# Altium schematic sheet 03.SchDoc
size 386 x 246 mm
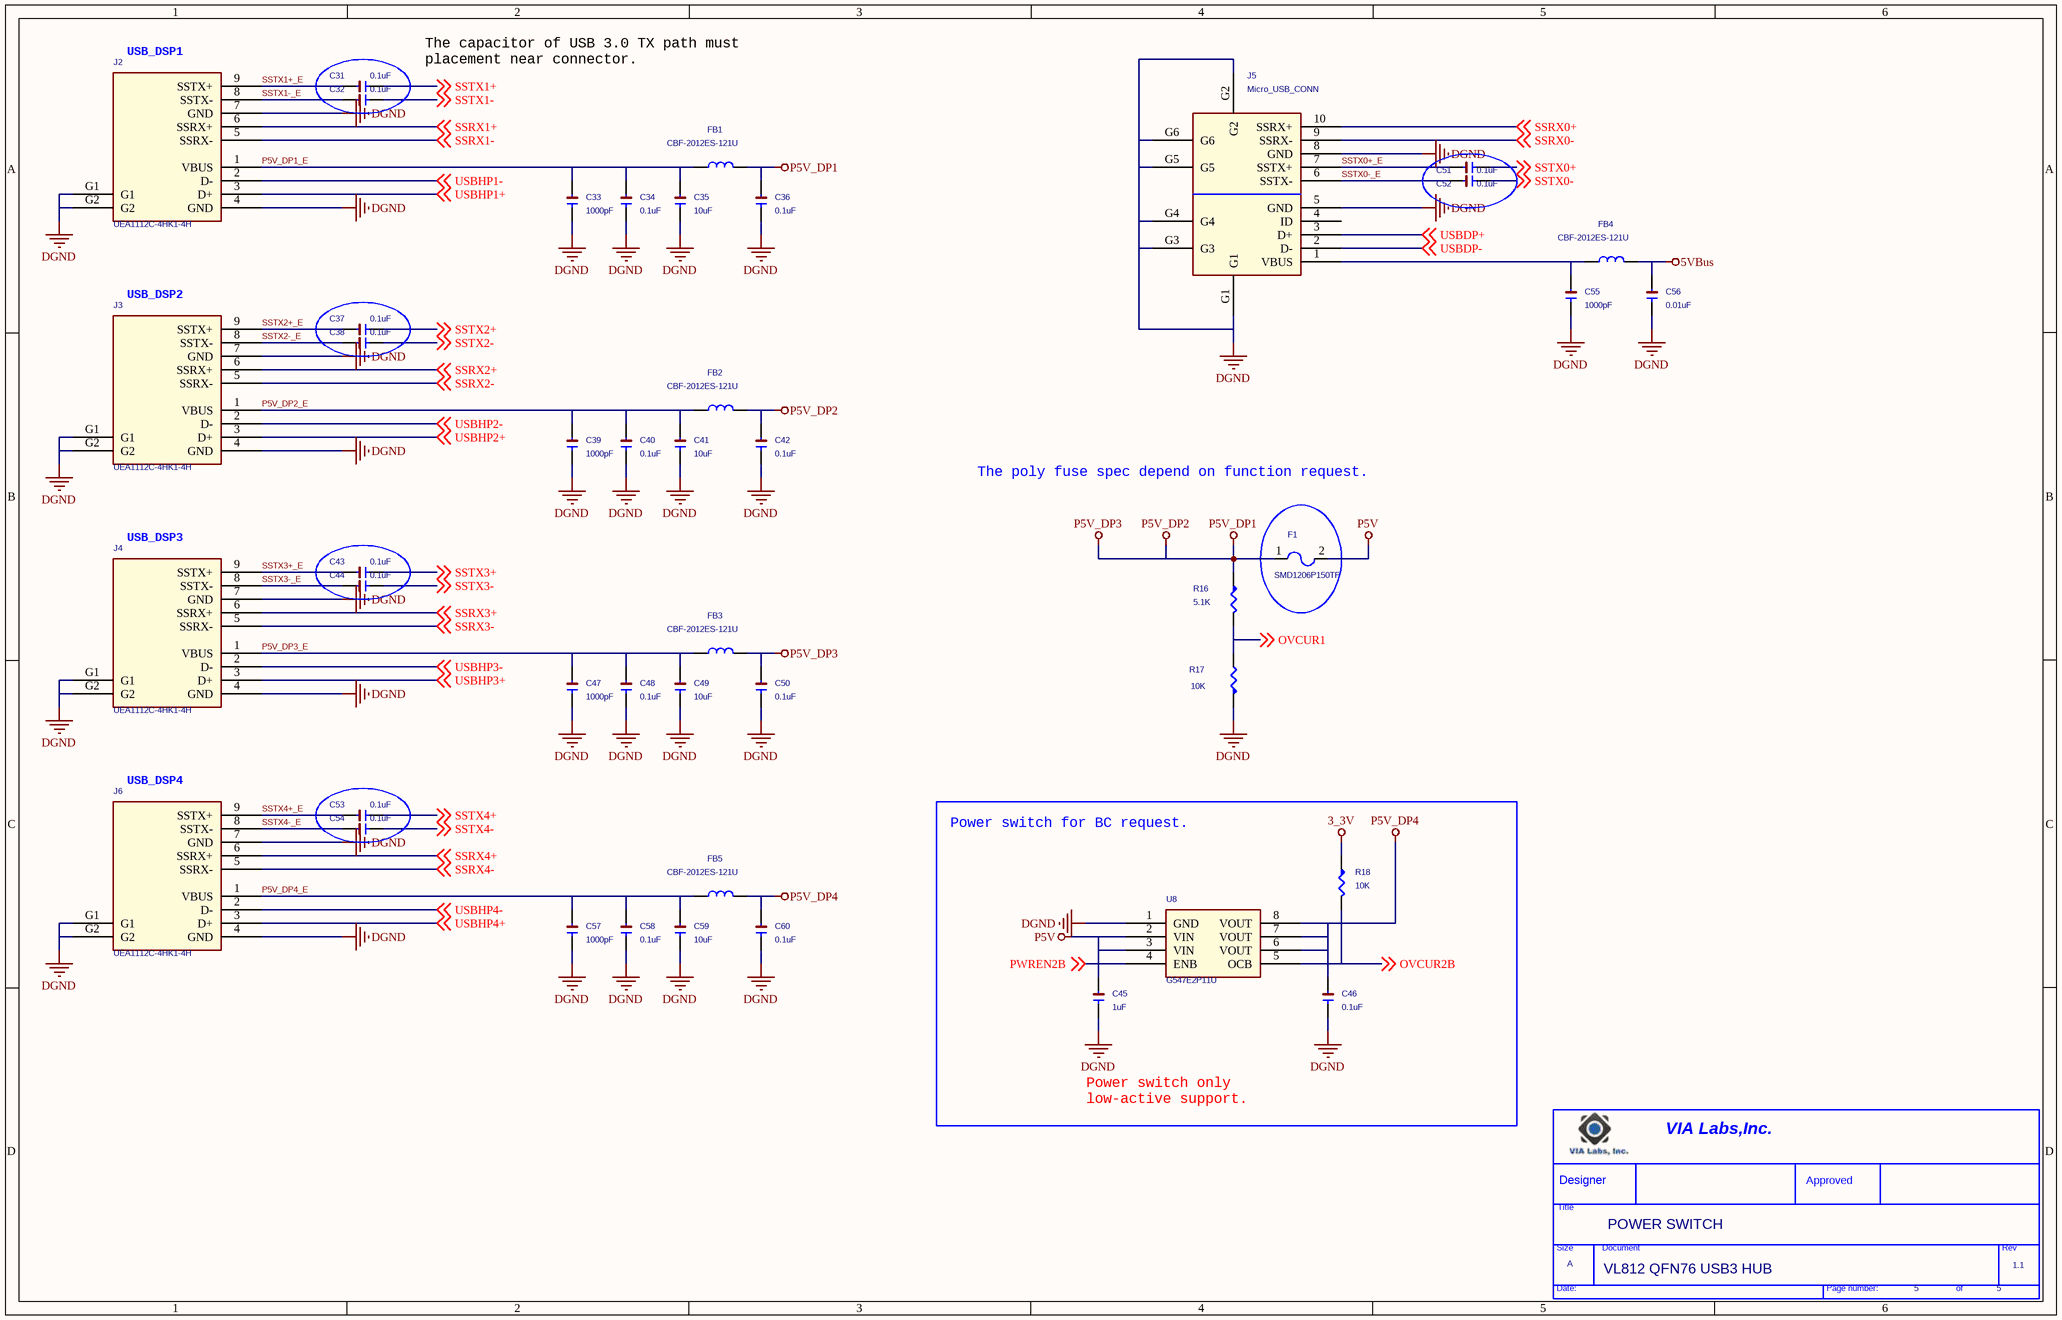
[diagram p0: 03.SchDoc]

## Parts
*  Page Count: 5  Page Size: A  Title: POWER SWITCH  RevCode: 1.1  Doc: VL812 QFN76 USB3 HUB  (hidden comment: TitleBlock0)  (graphical)
C31  0.1uF  [1206]
C32  0.1uF  [1206]
C33  1000pF  [1206]
C34  0.1uF  [1206]
C35  10uF  [1206]
C36  0.1uF  [1206]
C37  0.1uF  [1206]
C38  0.1uF  [1206]
C39  1000pF  [1206]
C40  0.1uF  [1206]
C41  10uF  [1206]
C42  0.1uF  [1206]
C43  0.1uF  [1206]
C44  0.1uF  [1206]
C45  1uF  [1206]
C46  0.1uF  [1206]
C47  1000pF  [1206]
C48  0.1uF  [1206]
C49  10uF  [1206]
C50  0.1uF  [1206]
C51  0.1uF  [1206]
C52  0.1uF  [1206]
C53  0.1uF  [1206]
C54  0.1uF  [1206]
C55  1000pF  [1206]
C56  0.01uF  [1206]
C57  1000pF  [1206]
C58  0.1uF  [1206]
C59  10uF  [1206]
C60  0.1uF  [1206]
F1  SMD1206P150TF  [FUSE1206]
FB1  CBF-2012ES-121U  [BEAD-CB-2012ES]
FB2  CBF-2012ES-121U  [BEAD-CB-2012ES]
FB3  CBF-2012ES-121U  [BEAD-CB-2012ES]
FB4  CBF-2012ES-121U  [BEAD-CB-2012ES]
FB5  CBF-2012ES-121U  [BEAD-CB-2012ES]
J2  UEA1112C-4HK1-4H  [USB-UEA11123-4HK1-4H]
J3  UEA1112C-4HK1-4H  [USB-UEA11123-4HK1-4H]
J4  UEA1112C-4HK1-4H  [USB-UEA11123-4HK1-4H]
J5  Micro_USB_CONN  [MicroUSB-B-S_D]
J6  UEA1112C-4HK1-4H  [USB-UEA11123-4HK1-4H]
R16  5.1K  [RES0402]
R17  10K  [RES0402]
R18  10K  [RES0402]
U8  G547E2P11U  [SOP-8]

## Blocks framed on the sheet
Power switch for BC request.: C45 C46 R18 U8

## Nets
3_3V: R18.1
5VBus: C56.2 FB4.2
DGND: C33.1 C34.1 C35.1 C36.1 C39.1 C40.1 C41.1 C42.1 C45.1 C46.1 C47.1 C48.1 C49.1 C50.1 C55.1 C56.1 C57.1 C58.1 C59.1 C60.1 J2.4(GND) J2.7(GND) J2.G1 J2.G2 J3.4(GND) J3.7(GND) J3.G1 J3.G2 J4.4(GND) J4.7(GND) J4.G1 J4.G2 J5.5(GND) J5.8(GND) J5.G1 J5.G2 J5.G3 J5.G4 J5.G5 J5.G6 J6.4(GND) J6.7(GND) J6.G1 J6.G2 R17.1 U8.1(GND)
P5V: C45.2 F1.2 U8.2(VIN) U8.3(VIN)
P5V_DP1: C36.2 C42.2 C50.2 F1.1 FB1.2 FB2.2 FB3.2 R16.1  [also labelled P5V_DP2, P5V_DP3]
P5V_DP4: C46.2 C60.2 FB5.2 U8.6(VOUT) U8.7(VOUT) U8.8(VOUT)
OVCUR1: R16.2 R17.2 ; off-sheet OVCUR1
OVCUR2B: R18.2 U8.5(OCB) ; off-sheet OVCUR2B
P5V_DP1_E: C33.2 C34.2 C35.2 FB1.1 J2.1(VBUS)
P5V_DP2_E: C39.2 C40.2 C41.2 FB2.1 J3.1(VBUS)
P5V_DP3_E: C47.2 C48.2 C49.2 FB3.1 J4.1(VBUS)
P5V_DP4_E: C57.2 C58.2 C59.2 FB5.1 J6.1(VBUS)
PWREN2B: U8.4(ENB) ; off-sheet PWREN2B
SSRX0+: J5.10(SSRX+) ; off-sheet SSRX0+
SSRX0-: J5.9(SSRX-) ; off-sheet SSRX0-
SSRX1+: J2.6(SSRX+) ; off-sheet SSRX1+
SSRX1-: J2.5(SSRX-) ; off-sheet SSRX1-
SSRX2+: J3.6(SSRX+) ; off-sheet SSRX2+
SSRX2-: J3.5(SSRX-) ; off-sheet SSRX2-
SSRX3+: J4.6(SSRX+) ; off-sheet SSRX3+
SSRX3-: J4.5(SSRX-) ; off-sheet SSRX3-
SSRX4+: J6.6(SSRX+) ; off-sheet SSRX4+
SSRX4-: J6.5(SSRX-) ; off-sheet SSRX4-
SSTX0+: C51.1 ; off-sheet SSTX0+
SSTX0+_E: C51.2 J5.7(SSTX+)
SSTX0-: C52.1 ; off-sheet SSTX0-
SSTX0-_E: C52.2 J5.6(SSTX-)
SSTX1+: C31.1 ; off-sheet SSTX1+
SSTX1+_E: C31.2 J2.9(SSTX+)
SSTX1-: C32.1 ; off-sheet SSTX1-
SSTX1-_E: C32.2 J2.8(SSTX-)
SSTX2+: C37.1 ; off-sheet SSTX2+
SSTX2+_E: C37.2 J3.9(SSTX+)
SSTX2-: C38.1 ; off-sheet SSTX2-
SSTX2-_E: C38.2 J3.8(SSTX-)
SSTX3+: C43.1 ; off-sheet SSTX3+
SSTX3+_E: C43.2 J4.9(SSTX+)
SSTX3-: C44.1 ; off-sheet SSTX3-
SSTX3-_E: C44.2 J4.8(SSTX-)
SSTX4+: C53.1 ; off-sheet SSTX4+
SSTX4+_E: C53.2 J6.9(SSTX+)
SSTX4-: C54.1 ; off-sheet SSTX4-
SSTX4-_E: C54.2 J6.8(SSTX-)
USBDP+: J5.3(D+) ; off-sheet USBDP+
USBDP-: J5.2(D-) ; off-sheet USBDP-
USBHP1+: J2.3(D+) ; off-sheet USBHP1+
USBHP1-: J2.2(D-) ; off-sheet USBHP1-
USBHP2+: J3.3(D+) ; off-sheet USBHP2+
USBHP2-: J3.2(D-) ; off-sheet USBHP2-
USBHP3+: J4.3(D+) ; off-sheet USBHP3+
USBHP3-: J4.2(D-) ; off-sheet USBHP3-
USBHP4+: J6.3(D+) ; off-sheet USBHP4+
USBHP4-: J6.2(D-) ; off-sheet USBHP4-
NetC55_2: C55.2 FB4.1 J5.1(VBUS)

Not connected (* = marked no-connect by the designer): J5 4(ID)

## Notes on the sheet
- (near J2) USB_DSP1
- The capacitor of USB 3.0 TX path must
  placement near connector.
- (near J3) USB_DSP2
- The poly fuse spec depend on function request.
- (near J4) USB_DSP3
- (near J6) USB_DSP4
- Power switch only
  low-active support.
- (in symbol TitleBlock0) VIA Labs,Inc.; Designer; Approved; Title; Size; Document; Rev; Date:; Page number:; of

## Library data of the parts
C31 C32 C34 C36-C38 C40 C42-C44 C46 C48 C50 C58 C60 = C: Part Number: 99G12-006525; QUAN: 34,490; Qualify: YES; Dsc8: TAIYO; Dsc7: EMK105BJ104KV; Dsc6: SMT0402,THICKNESS=0.50mm; Dsc5: X5R; Dsc4: 16V; Dsc3: K; Dsc1: CAP ML; approval status: A; 弧: CAP ML0.1 uFZ16VY5VSMT0402,THICKNESS=0.50∮0.05mmCC; ID: 16,890; DSCX: CAP ML 0.1 uF K 16V X5R SMT0402,THICKNESS=0.50mm EMK105BJ104KV TAIYO; Date: 12302002; Cost: 0; Part Type: SMD CAP; Dsc2: 0.1 uF
C33 C39 C47 C55 C57 = C: Part Number: 99G12-005476; ID: 17853; 弧: CAP ML1000 pFK50VX7RSMT0402,THICKNESS=0.50∮0.05mmC; approval status: NA; Dsc1: CAP ML; Dsc3: K; Dsc4: 50V; Dsc5: X7R; Dsc6: SMT0402,THICKNESS=0.50∮0.05mm; Dsc7: CC0402KRX7R9BB102; Dsc8: YAGEO; Qualify: YES; QUAN: 6933; DSCX: CAP ML 1000 pF K 50V X7R SMT0402,THICKNESS=0.50∮0.05mm CC0402KRX7R9BB102 YAGEO; Date: 12302002; Dsc2: 1000 pF; Part Type: SMD CAP; Cost: 0.00
C35 C41 C49 C59 = C: Part Number: 99G12-00037B; ID: 17481; 弧: CAP ML 10 uF Z 16V Y5V SMT1210; approval status: A; Dsc1: CAP ML; Dsc3: Z; Dsc4: 16V; Dsc5: Y5V; Dsc6: SMT1210,THICKNESS=1.25∮0.20mm; Dsc7: C3225Y5V106ZEP; Dsc8: DARFON; Qualify: YES; QUAN: 11124; DSCX: CAP ML 10 uF Z 16V Y5V SMT1210,THICKNESS=1.25∮0.20mm C3225Y5V106ZEP DARFON; Date: 12302002; Dsc2: 10 uF; Part Type: SMD CAP; Cost: 0.03
C45 = C: Part Number: 99G12-00009B; ID: 17426; 弧: CAP ML 1 uF Z 10V Y5V SMT0603,; approval status: A; Dsc1: CAP ML; Dsc3: Z; Dsc4: 10V; Dsc5: Y5V; Dsc6: SMT0603,THICKNESS=0.80∮0.10mm; Dsc7: C1608Y5V105ZDT; Dsc8: DARFON; Qualify: YES; QUAN: 13000; DSCX: CAP ML 1 uF Z 10V Y5V SMT0603,THICKNESS=0.80∮0.10mm C1608Y5V105ZDT DARFON; Date: 12302002; Dsc2: 1 uF; Part Type: SMD CAP; Cost: 0.00
C51-C54 = C: Part Number: 99G12-006525; ID: 16,890; 弧: CAP ML0.1 uFZ16VY5VSMT0402,THICKNESS=0.50∮0.05mmCC; approval status: A; Dsc1: CAP ML; Dsc3: K; Dsc4: 16V; Dsc5: X5R; Dsc6: SMT0402,THICKNESS=0.50mm; Dsc7: EMK105BJ104KV; Dsc8: TAIYO; Qualify: YES; QUAN: 34,490; DSCX: CAP ML 0.1 uF K 16V X5R SMT0402,THICKNESS=0.50mm EMK105BJ104KV TAIYO; Date: 12302002; Dsc2: 0.1 uF; Part Type: SMD CAP; Cost: 0
C56 = C: Part Number: 99G12-005696; ID: 17869; 弧: CAP ML0.01 uFZ16VY5VSMT0402,THICKNESS=0.50∮0.05mmC; approval status: NA; Dsc1: CAP ML; Dsc3: Z; Dsc4: 16V; Dsc5: Y5V; Dsc6: SMT0402,THICKNESS=0.50∮0.05mm; Dsc7: CC0402ZRY5V7BB103; Dsc8: YAGEO; Qualify: YES; QUAN: 10000; DSCX: CAP ML 0.01 uF Z 16V Y5V SMT0402,THICKNESS=0.50∮0.05mm CC0402ZRY5V7BB103 YAGEO; Date: 12302002; Dsc2: 0.01 uF; Part Type: SMD CAP; Cost: 0.00
F1 = FUSE: Part Number: 99G28-030141; QUAN: 18458; Approval Sheet: \\tp_mi05\BackUp\VPSD\Data Sheet\Data Sheet\99G\99G28-03\99G28-030141.pdf; Qualify: YES; Dsc8: PTTC; Dsc3: 1.5A; Dsc1: SWITCH POLY; approval status: CA; 弧: SWITCH POLY SMD1206P150TF 1.5A; ID: 18715; Date: 01072003; Cost: 0.05; Part Type: SMD FUSE; Dsc4: SMD1206; Dsc2: SMD1206P150TF
FB1-FB5 = BEAD: Part Number: 99G23-04003G; ID: 20,009; 弧: FERRITE BEAD CBF-2012ES-121U 1; approval status: A; Dsc1: FERRITE BEAD; Dsc3: 120 OHM; Dsc4: 25%; Dsc5: 5000mA; Dsc6: SMT0805; Dsc8: C&C; Qualify: YES; Approval Sheet: \\tp_mi05\BackUp\VPSD\Data Sheet\99G\99G23-04\99G23-04003G.pdf; QUAN: 6,805; DSCX: FERRITE BEAD CBF-2012ES-121U 120 OHM 25% 5000mA SMT0805  C&C; Date: 12302002; Dsc2: CBF-2012ES-121U; Part Type: SMD BEAD; Cost: 0
J2-J4 = USB-UEA11123-4HK1-4H: Part Number: 99G30-060617; ID: 19968; 弧: CONN USB SINGLE A TYPE USB 3.0; approval status: PL; Dsc1: CONN USB; Dsc2: SINGLE A TYPE USB 3.0; Dsc4: 9PIN; Dsc5: RIGHT ANGLE; Dsc6: DIP; Dsc7: BLUE; Dsc8: FOXCONN; Qualify: YES; QUAN: 0; Date: 02042009; Dsc3: UEA1112C-4HK1-4H; Part Type: DIP CONN; Cost: 0.90
J5 = USB-UEB11123-2JK1-4H_0: QUAN: 0; Qualify: YES; Dsc8: FOXCONN; Dsc7: BLUE; Dsc6: DIP; Dsc5: RIGHT ANGLE; Dsc4: 9PIN; Dsc3: UEB1112C-2AK1-4H; Dsc2: SINGLE B TYPE USB 3.0; Dsc1: CONN USB; approval status: PL; 弧: CONN USB SINGLE B TYPE USB 3.0; ID: 19328; Date: 02042009; Cost: 2.45; Part Type: DIP CONN
J6 = USB-UEA11123-4HK1-4H: Part Number: 99G30-060617; QUAN: 0; Qualify: YES; Dsc8: FOXCONN; Dsc7: BLUE; Dsc6: DIP; Dsc5: RIGHT ANGLE; Dsc4: 9PIN; Dsc2: SINGLE A TYPE USB 3.0; Dsc1: CONN USB; approval status: PL; 弧: CONN USB SINGLE A TYPE USB 3.0; ID: 19968; Date: 02042009; Cost: 0.90; Part Type: DIP CONN; Dsc3: UEA1112C-4HK1-4H
R16 = R: Part Number: 99G19-002653; QUAN: 81,590; Qualify: YES; Dsc8: YAGEO; Dsc7: RC0402JR-075K1L; Dsc6: SMT0402,THICKNESS=0.35∮0.05mm; Dsc5: CF; Dsc4: 1/16W; Dsc3: J; Dsc2: 5.1K OHM; Dsc1: RES CHIP; approval status: PL; 弧: RES CHIP 5.1K OHM J 1/16W CF S; ID: 17,696; DSCX: RES CHIP 5.1K OHM J 1/16W CF SMT0402,THICKNESS=0.35∮0.05mm RC0402JR-075K1L YAGEO; Date: 12302002; Cost: 0; Part Type: SMD RES
R17 R18 = R: Part Number: 99G19-001453; DSCX: RES CHIP 10K OHM J 1/16W CF SMT0402,THICKNESS=0.35∮0.05mm RC0402JR-0710KL YAGEO; QUAN: 15,463; Qualify: YES; Dsc8: YAGEO; Dsc7: RC0402JR-0710KL; Dsc6: SMT0402,THICKNESS=0.35∮0.05mm; Dsc5: CF; Dsc4: 1/16W; Dsc3: J; Dsc2: 10K OHM; Dsc1: RES CHIP; approval status: NA; 弧: RES CHIP 10K OHM J 1/10W CF SM; ID: 17,537; Date: 12302002; Cost: 0; Part Type: SMD RES
* = TitleBlock0: Page Number: 5; Page Create Date: March  8, 1995